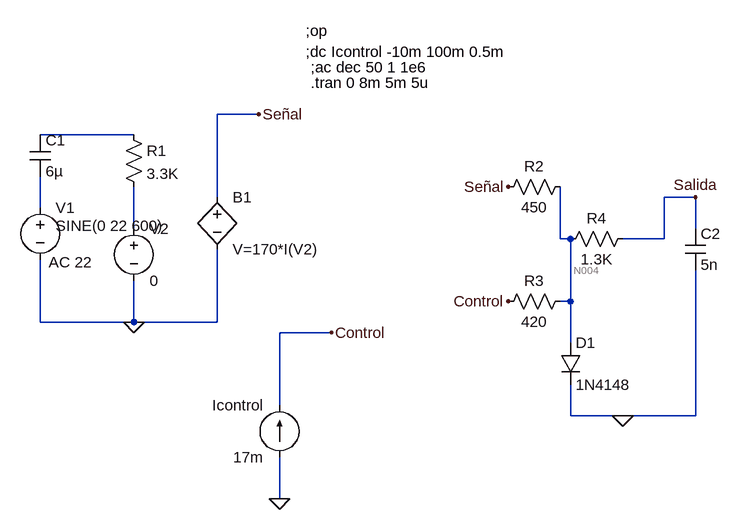
[diagram p0: schematic práctica1_tutorial.asc]
práctica1_tutorial.asc, the LTspice schematic file:
Version 4
SHEET 1 912 680
WIRE 176 32 112 32
WIRE -16 64 -160 64
WIRE 112 160 112 32
WIRE 848 160 800 160
WIRE -160 176 -160 128
WIRE -16 208 -16 144
WIRE 848 208 848 160
WIRE 640 224 640 144
WIRE 656 224 640 224
WIRE 800 224 800 160
WIRE 800 224 736 224
WIRE 656 320 656 224
WIRE 656 320 640 320
WIRE -160 352 -160 256
WIRE -16 352 -16 288
WIRE -16 352 -160 352
WIRE 112 352 112 240
WIRE 112 352 -16 352
WIRE 288 368 208 368
WIRE 656 384 656 320
WIRE 208 480 208 368
WIRE 656 496 656 448
WIRE 736 496 656 496
WIRE 848 496 848 272
WIRE 848 496 736 496
WIRE 208 624 208 560
FLAG -16 352 0
FLAG 208 624 0
FLAG 176 32 Señal
FLAG 560 144 Señal
FLAG 288 368 Control
FLAG 560 320 Control
FLAG 848 160 Salida
FLAG 736 496 0
SYMBOL res -32 48 R0
SYMATTR InstName R1
SYMATTR Value 3.3K
SYMBOL res 656 128 R90
WINDOW 0 0 56 VBottom 2
WINDOW 3 32 56 VTop 2
SYMATTR InstName R2
SYMATTR Value 450
SYMBOL res 656 304 R90
WINDOW 0 0 56 VBottom 2
WINDOW 3 32 56 VTop 2
SYMATTR InstName R3
SYMATTR Value 420
SYMBOL res 752 208 R90
WINDOW 0 0 56 VBottom 2
WINDOW 3 32 56 VTop 2
SYMATTR InstName R4
SYMATTR Value 1.3K
SYMBOL cap -176 64 R0
SYMATTR InstName C1
SYMATTR Value 6µ
SYMBOL cap 832 208 R0
SYMATTR InstName C2
SYMATTR Value 5n
SYMBOL voltage -160 160 R0
WINDOW 3 24 44 Left 2
WINDOW 123 13 100 Left 2
WINDOW 39 0 0 Left 0
SYMATTR Value SINE(0 22 600)
SYMATTR Value2 AC 22
SYMATTR InstName V1
SYMBOL voltage -16 192 R0
WINDOW 123 0 0 Left 0
WINDOW 39 0 0 Left 0
SYMATTR InstName V2
SYMATTR Value 0
SYMBOL current 208 560 R180
WINDOW 0 24 80 Left 2
WINDOW 3 24 0 Left 2
WINDOW 123 0 0 Left 0
WINDOW 39 0 0 Left 0
SYMATTR InstName Icontrol
SYMATTR Value 17m
SYMBOL diode 640 384 R0
SYMATTR InstName D1
SYMATTR Value 1N4148
SYMBOL bv 112 144 R0
SYMATTR InstName B1
SYMATTR Value V=170*I(V2)
TEXT 248 -96 Left 2 !;op
TEXT 248 -64 Left 2 !;dc Icontrol -10m 100m 0.5m
TEXT 256 -40 Left 2 !;ac dec 50 1 1e6
TEXT 256 -16 Left 2 !.tran 0 8m 5m 5u

The netlist it stands for:
* práctica1_tutorial.asc
R1 N001 N003 3.3K
R2 N004 Señal 450
R3 N004 Control 420
R4 Salida N004 1.3K
C1 N001 N002 6µ
C2 Salida 0 5n
V1 N002 0 SINE(0 22 600) AC 22
V2 N003 0 0
Icontrol 0 Control 17m
D1 N004 0 1N4148
B1 Señal 0 V=170*I(V2)
.model D D
.lib standard.dio
;op
;dc Icontrol -10m 100m 0.5m
;ac dec 50 1 1e6
.tran 0 8m 5m 5u
.backanno
.end

* Results of the author's LTspice run, read from the files saved beside the schematic
* Operating Point, zero values left out:
*   V(n004) = 716.9 mV
*   V(control) = 7.857 V
*   V(salida) = 716.9 mV
*   I(B1) = 1.593 mA
*   I(D1) = 15.41 mA
*   I(Icontrol) = 17 mA
*   I(R3) = -17 mA
*   I(R2) = 1.593 mA